# EAGLE design max6_breakout (EAGLE 6.2)
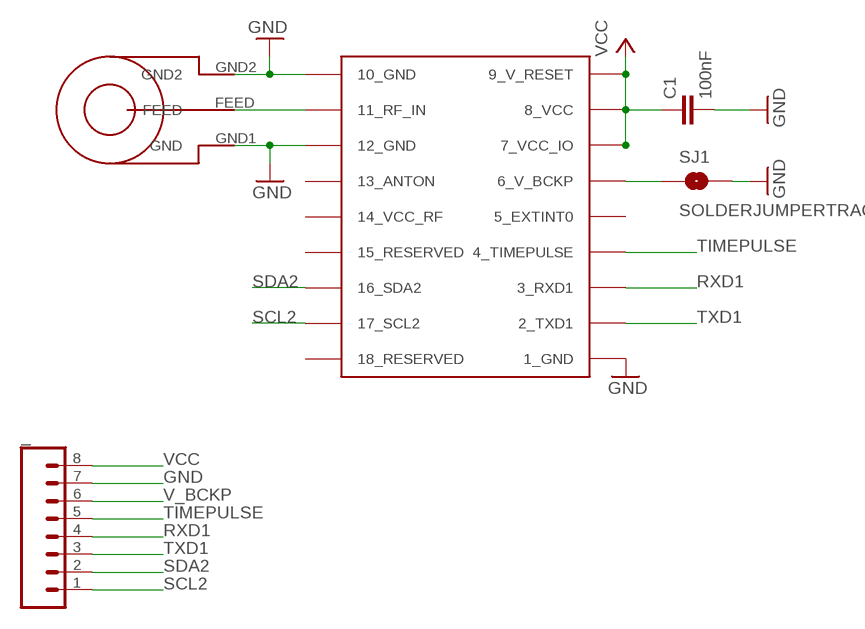
[diagram p0: schematic, sheet 1]

## Parts
_  M081X08  [1X08]
C1  100nF  CAP0603-CAP  [0603-CAP]
SJ1  SOLDERJUMPERTRACE  [SJ_2S-TRACE]
U$1  UBLOX_MAX-6  [UBLOX_MAX-6]
U$2  SARANTEL-SR1202  [SARANTEL-SR1202]

## Nets
GND: _.7 C1.2 SJ1.2 U$1.1_GND U$1.10_GND U$1.12_GND U$2.GND1(GND) U$2.GND2
N$2: U$1.11_RF_IN U$2.FEED
RXD1: _.4 U$1.3_RXD1
SCL2: _.1 U$1.17_SCL2
SDA2: _.2 U$1.16_SDA2
TIMEPULSE: _.5 U$1.4_TIMEPULSE
TXD1: _.3 U$1.2_TXD1
V_BCKP: _.6 SJ1.1 U$1.6_V_BCKP
VCC: _.8 C1.1 U$1.7_VCC_IO U$1.8_VCC U$1.9_V_RESET
Unconnected: U$1.5_EXTINT0 U$1.13_ANTON U$1.14_VCC_RF U$1.15_RESERVED U$1.18_RESERVED

## Library data of the parts
_ = SparkFun:M08: Header 8 Standard 8-pin 0.1" header. Use with straight break away headers (SKU : PRT-00116), right angle break away headers (PRT-00553), swiss pins (PRT-00743), machine pins (PRT-00117), and female headers (PRT-00115).
C1 = SparkFun:CAP: Capacitor Standard 0603 ceramic capacitor, and 0.1" leaded capacitor.
SJ1 = SparkFun:SOLDERJUMPER: Solder Jumper Standard SMD solder jumper. Used to automate production. Two varients : Normally Open and Normally Closed are the same, but have different paste layers. NC will have a large amount of paste and should jumper during reflow.
U$1 = ava:UBLOX_MAX-6: UBLOX MAX-6
U$2 = ava:SARANTEL-SR1202: SARANTEL-SL1202 Author Anthony Stirk / http://ava.upuaut.net Data Sheet : http://docs-europe.electrocomponents.com/webdocs/0dbd/0900766b80dbde80.pdf

## Board
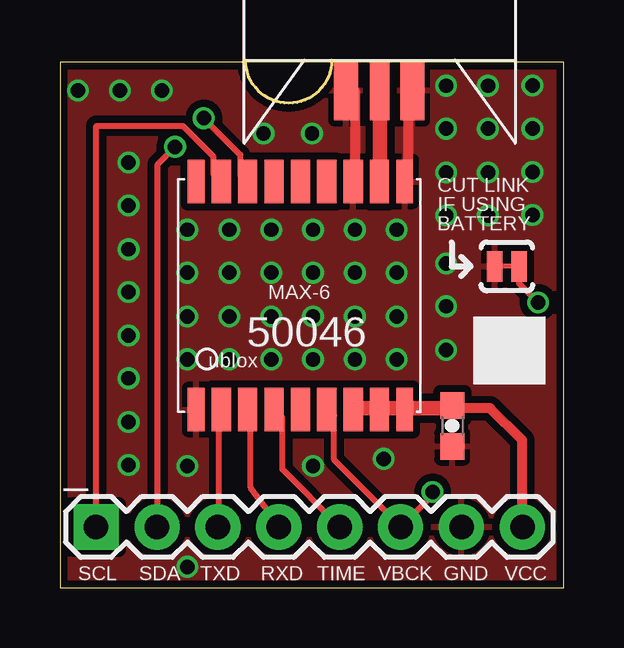
[diagram p1: board, top side]
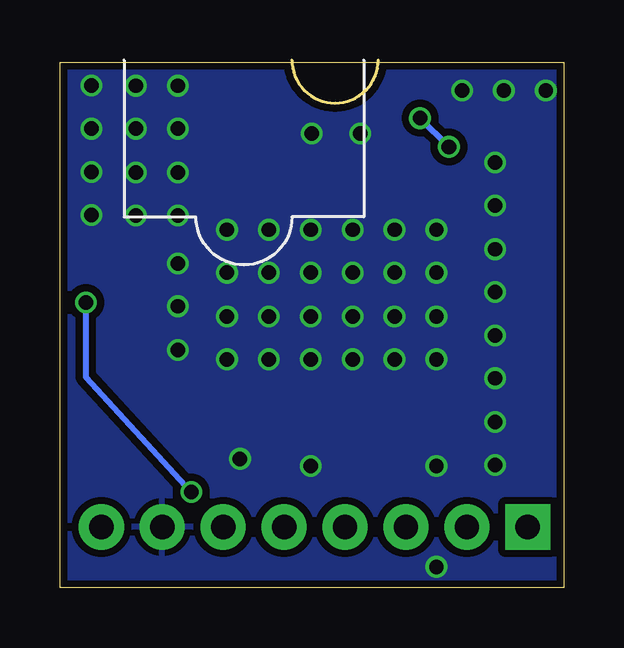
[diagram p2: board, bottom side, seen from below]

Size 21.01 x 21.9 mm. Coordinates in mm from the lower left corner, seen from the top.
Outline: 0,0 21.01,0 21.01,21.9 0,21.9 0,0
Copper layers (1*16): Top 0.035mm / dielectric 1.5mm / Bottom 0.035mm
Design rules: minimum track width 6mil, minimum drill 12mil, track to track 6mil, track to pad 6mil, pad to pad 6mil, via to via 6mil, smd to smd 0mil, copper to edge 10mil, drill to drill 10mil, minimum pad ring 10mil, minimum via ring 6mil, stop-mask expansion 2mil, vias tented up to drill 100mil, thermal gap 10mil

### Footprints (pad centres in the part's own frame; a part is rotated, then mirrored left to right if it is on the bottom)
1X08 = drill 1.016 pad 1.88 square: 1 0,0 | drill 1.016 pad 1.88: 2 2.54,0; 3 5.08,0; 4 7.62,0; 5 10.16,0; 6 12.7,0; 7 15.24,0; 8 17.78,0
0603-CAP = smd 1.1 x 1: 1 -0.85,0; 2 0.85,0
SJ_2S-TRACE = smd 0.635 x 1.27: 1 -0.508,0; 2 0.508,0
UBLOX_MAX-6 = smd 1.8 x 0.7: 1_GND 4.95,-4.4; 9_V_RESET 4.95,4.3; 10_GND -4.55,4.3; 18_RESERVED -4.55,-4.4 | smd 1.8 x 0.8: 2_TXD1 4.95,-3.35; 3_RXD1 4.95,-2.25; 4_TIMEPULSE 4.95,-1.15; 5_EXTINT0 4.95,-0.05; 6_V_BCKP 4.95,1.05; 7_VCC_IO 4.95,2.15; 8_VCC 4.95,3.25; 11_RF_IN -4.55,3.25; 12_GND -4.55,2.15; 13_ANTON -4.55,1.05; 14_VCC_RF -4.55,-0.05; 15_RESERVED -4.55,-1.15; 16_SDA2 -4.55,-2.25; 17_SCL2 -4.55,-3.35
SARANTEL-SR1202 = smd 2.5 x 0.8: FEED 0,0 | smd 2.5 x 1: GND1 0,1.4; GND2 0,-1.35

### Placement (x,y rotation side)
_  1.5,2.54 0 top
C1  16.36,6.75 270 top
SJ1  18.63,13.4 180 top
U$1  10.08,12.38 270 top
U$2  13.34,20.73 90 top

### Tracks (layer width: path | path; a pad name or v marks a point on that pad's centre or on a via)
GND  (via drill 0.6)
  Top 0.406: U$1.10_GND 14.52,16.62 14.52,20.73 U$2.GND2 | U$2.GND1 12.3,20.73 12.3,16.83
  other vias: 13.5,5.38 10.51,18.93 8.49,18.93 5.32,14.92 5.32,9.53 5.32,13.14 5.32,11.31 7.06,14.92 7.06,13.14 7.06,11.31 7.06,9.53 8.81,9.53 8.81,11.31 8.81,13.14 8.81,14.92 10.55,14.92 10.55,13.14 10.55,11.31 10.55,9.53 12.3,9.53 12.3,11.31 12.3,13.14 12.3,14.92 14.05,14.92 14.05,13.14 14.05,11.31 14.05,9.53 10.55,5.08 5.32,5.08 2.86,17.72 2.86,15.94 2.86,14.11 2.86,12.33 2.86,10.52 2.86,8.74 2.86,6.91 2.86,5.13 16.1,17.31 16.1,19.14 16.1,20.92 17.85,20.92 17.85,19.14 17.85,17.31 19.7,19.14 19.7,20.94 19.7,17.34 16.1,9.91 16.1,11.74 16.1,13.52 16.1,15.51 17.85,15.51 19.7,15.54 0.75,20.72 2.5,20.72 4.25,20.72 5.32,0.88
  pour Bottom (isolate 0.305): -0.4,21.91 21.51,21.91 21.51,0 -0.4,0
  pour Top (isolate 0.305): -0.4,21.91 21.51,21.91 21.51,0 -0.4,0
N$2
  Top 0.406: U$1.11_RF_IN 13.34,16.62
  Top 0.61: 13.34,16.62 U$2.FEED
RXD1
  Top 0.254: U$1.3_RXD1 7.96,7.3 7.96,4.18 9.12,2.62 _.4
SCL2
  Top 0.254: U$1.17_SCL2 6.4,17.26 6.4,17.98 5.12,19.26 1.52,19.26 1.52,2.62 _.1
SDA2  (via drill 0.61)
  Top 0.254: v6,19.58 7.52,18.06 7.52,17.18 7.75,16.94 U$1.16_SDA2 | v4.79,18.38 4.08,17.66 4.08,2.62 _.2
  Bottom 0.254: v4.79,18.38 v6,19.58
TIMEPULSE
  Top 0.254: U$1.4_TIMEPULSE 8.96,7.42 9.27,7.1 9.27,4.94 11.59,2.62 _.5
TXD1
  Top 0.254: U$1.2_TXD1 6.64,7.34 6.64,2.62 _.3
V_BCKP  (via drill 0.6)
  Top 0.254: 14.23,2.54 _.6 | U$1.6_V_BCKP 11.2,7.42 11.43,7.18 11.43,5.34 14.15,2.62 _.6 | SJ1.1 19.14,12.69 v19.93,11.9 | v15.54,4 15.54,3.87 _.6
  Bottom 0.254: v19.93,11.9 19.93,8.8 v15.54,4
VCC
  Top 0.254: 12.23,7.5 U$1.7_VCC_IO | 13.27,7.5 U$1.8_VCC 13.43,7.5 | 14.39,7.26 14.39,7.42 U$1.9_V_RESET 14.31,7.5 | 16.33,7.21 C1.1 | 19.27,2.62 _.8
  Top 0.406: 19.27,2.62 19.27,6.16 17.93,7.5 16.46,7.5 C1.1 | 16.33,7.21 16.33,7.6 16.34,7.5 | 14.44,7.5 U$1.9_V_RESET
  Top 0.61: 13.27,7.5 12.23,7.5 | 14.31,7.5 13.43,7.5 | 16.34,7.5 14.44,7.5

### Text on the board
tPlace: CUT LINK | IF USING | BATTERY
tNames: 50046 | SCL | SDA | TXD | RXD | TIME | VBCK | GND | VCC